# Altium project SOS_PAT.PrjPcb
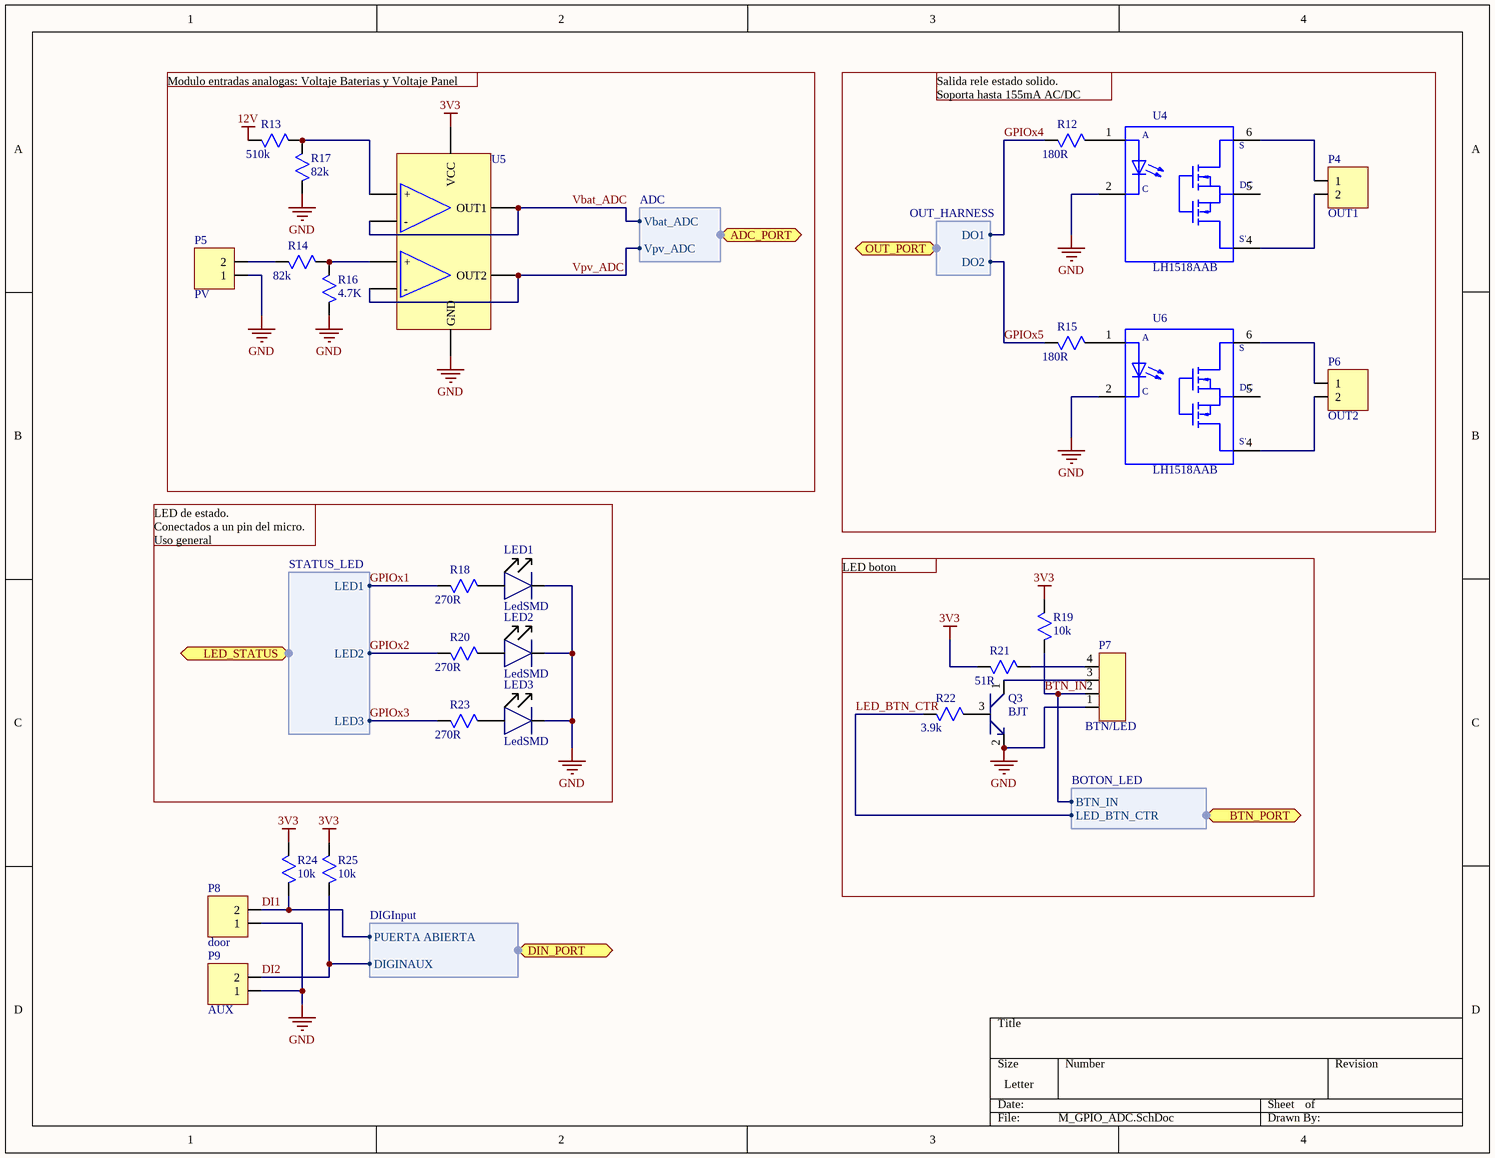
[diagram p0: M_GPIO_ADC.SchDoc]
4 sheets, 117 parts. Net scope: flat (ports and power ports of the same name join across sheets).
Board file: PATSOS_v1.PcbDoc
Sheets:
  M_GPIO_ADC.SchDoc
  M_microcontrolador.SchDoc
  M_Audio.SchDoc
  M_PWR.SchDoc

## Sheet M_GPIO_ADC.SchDoc
size Letter

### Parts
LED1  LedSMD  [SMD1206]
LED2  LedSMD  [SMD1206]
LED3  LedSMD  [SMD1206]
P4  OUT1  [TBHDR2P3.5VERTICAL]
P5  PV  [TBHDR2P3.5VERTICAL]
P6  OUT2  [TBHDR2P3.5VERTICAL]
P7  BTN/LED  [TBHDR4P3.5]
P8  door  [TBHDR2P3.5VERTICAL]
P9  AUX  [TBHDR2P3.5VERTICAL]
Q3  BJT  [BJT]
R12  value 180R  [ResistorSMD0805]  (hidden comment: ResistorSMD)
R13  value 510k  [ResistorSMD0805]  (hidden comment: ResistorSMD)
R14  value 82k  [ResistorSMD0805]  (hidden comment: ResistorSMD)
R15  value 180R  [ResistorSMD0805]  (hidden comment: ResistorSMD)
R16  value 4.7K  [ResistorSMD0805]  (hidden comment: ResistorSMD)
R17  value 82k  [ResistorSMD0805]  (hidden comment: ResistorSMD)
R18  value 270R  [ResistorSMD0805]  (hidden comment: ResistorSMD)
R19  value 10k  [ResistorSMD0805]  (hidden comment: ResistorSMD)
R20  value 270R  [ResistorSMD0805]  (hidden comment: ResistorSMD)
R21  value 51R  [ResistorSMD0805]  (hidden comment: ResistorSMD)
R22  value 3.9k  [ResistorSMD0805]  (hidden comment: ResistorSMD)
R23  value 270R  [ResistorSMD0805]  (hidden comment: ResistorSMD)
R24  value 10k  [ResistorSMD0805]  (hidden comment: ResistorSMD)
R25  value 10k  [ResistorSMD0805]  (hidden comment: ResistorSMD)
U4  LH1518AAB  [SOIC254P1005X390-6N]
U5  Operacional  [SO8]  (value not drawn)
U6  LH1518AAB  [SOIC254P1005X390-6N]

### Ports
ADC_PORT (harness ADC), BTN_PORT (harness BOTON_LED), DIN_PORT (harness DIGInput), LED_STATUS (harness STATUS_LED), OUT_PORT (harness OUT_HARNESS)

### Harnesses
ADC: Vbat_ADC, Vpv_ADC
STATUS_LED: LED1, LED2, LED3
BOTON_LED: BTN_IN, LED_BTN_CTR
OUT_HARNESS: DO1, DO2
DIGInput: PUERTA ABIERTA, DIGINAUX

### Nets
3V3: R19.2 R21.1 R24.2 R25.2 U5.8(VCC)
12V: R13.1
GND: LED1.1 LED2.1 LED3.1 P5.1 P7.1 P8.1 P9.1 Q3.2 R16.1 R17.1 U4.2(C) U5.4(GND) U6.2(C)  [project net GND-GSM]
BTN_IN: P7.2 R19.1 ; port BTN_PORT.BTN_IN
DI1: P8.2 R24.1 ; port DIN_PORT.PUERTA ABIERTA
DI2: P9.2 R25.1 ; port DIN_PORT.DIGINAUX
GPIOx1: R18.1 ; port LED_STATUS.LED1
GPIOx2: R20.1 ; port LED_STATUS.LED2
GPIOx3: R23.1 ; port LED_STATUS.LED3
GPIOx4: R12.1 ; port OUT_PORT.DO1
GPIOx5: R15.1 ; port OUT_PORT.DO2
LED_BTN_CTR: R22.1 ; port BTN_PORT.LED_BTN_CTR
Vbat_ADC: U5.1(OUT1) U5.2(-) ; port ADC_PORT.Vbat_ADC
Vpv_ADC: U5.6(-) U5.7(OUT2) ; port ADC_PORT.Vpv_ADC
NetLED1_2: LED1.2 R18.2
NetLED2_2: LED2.2 R20.2
NetLED3_2: LED3.2 R23.2
NetP4_1: P4.1 U4.6(S)
NetP4_2: P4.2 U4.4(S')
NetP5_2: P5.2 R14.1
NetP6_1: P6.1 U6.6(S)
NetP6_2: P6.2 U6.4(S')
NetP7_3: P7.3 Q3.1
NetP7_4: P7.4 R21.2
NetQ3_3: Q3.3 R22.2
NetR12_2: R12.2 U4.1(A)
NetR13_2: R13.2 R17.2 U5.3(+)
NetR14_2: R14.2 R16.2 U5.5(+)
NetR15_2: R15.2 U6.1(A)

Not connected (* = marked no-connect by the designer): U4 5(DC); U6 5(DC)

### Notes on the sheet
- Modulo entradas analogas: Voltaje Baterias y Voltaje Panel solar
- Salida rele estado solido.
  Soporta hasta 155mA AC/DC
- LED de estado.
  Conectados a un pin del micro.
  Uso general
- LED boton

### Library data of the parts
LED1-LED3 = LedSMD: Discrete Led SMD 1205 Green; PartNo: LTST-C150GKT; Manufacturer Name: Lite-On Inc.; PartDescription: LED GREEN CLEAR 1206 SMD; Type: Surface Mount; Digi-Key Part Number: 160-1169-1-ND; Package: 1206 (3216 Metric); Distributors Part Number: 160-1169-1-ND; Manufacturers Part Number: LTST-C150GKT
P4-P6 P8 P9 = TBHDR2P3.5: Connector 2 positions with pitch 3.5mm; PartNo: 691321100002; Manufacturer Name: Wurth Electronics Inc.; PartDescription: TERM BLOCK HDR 2POS VERT 3.5MM; Digi-Key Part Number: 732-2763-ND; Package: 0.138" (3.50mm) Vertical Through Hole; Distributors Part Number: 732-2763-ND; Manufacturers Part Number: 691321100002; Type: Through Hole; Value: 2 Position
P7 = TBHDR4P3.5: Connector 4 positions; PartNo: 691321100004; Manufacturer Name: Wurth Electronics Inc.; PartDescription: TERM BLOCK HDR 4POS VERT 3.5MM; Digi-Key Part Number: 732-2765-ND; Package: 0.138" (3.50mm) Vertical Through Hole; Distributors Part Number: 732-2765-ND; Manufacturers Part Number: 691321100004; Type: Through Hole; Value: 4 Position
Q3 = BJT: Transistor BJT; Manufacturer Name: Diodes Incorporated; Manufacturers Part Number: MMBT2222A-7-F; PartDescription: TRANS NPN 40V 0.6A SMD SOT23-3; Type: Surface Mount; Digi-Key Part Number: MMBT2222A-FDICT-ND; Distributors Part Number: MMBT2222A-FDICT-ND; Package: TO-236-3, SC-59, SOT-23-3; PartNo: MMBT2222A-7-F
R12 R15 = ResistorSMD: Chip Resistor SMD; Manufacturer Name: Yageo; Manufacturers Part Number: RC0805FR-07180RL; PartDescription: RES SMD 180 OHM 1% 1/8W 0805; Digi-Key Part Number: 311-180CRCT-ND; Distributors Part Number: 311-180CRCT-ND; Package: 0805 (2012 Metric); PartNo: RC0805FR-07180RL; Type: Surface Mount
R13 = ResistorSMD: Chip Resistor SMD; PartNo: RC0805FR-07510KL; Manufacturer Name: Yageo; PartDescription: RES SMD 510K OHM 1% 1/8W 0805; Digi-Key Part Number: 311-510KCRCT-ND; Package: 0805; Distributors Part Number: 311-510KCRCT-ND; Manufacturers Part Number: RC0805FR-07510KL; Type: Surface Mount
R14 R17 = ResistorSMD: Chip Resistor SMD; PartNo: RC0805FR-0782KL; Manufacturer Name: Yageo; PartDescription: RES SMD 82K OHM 1% 1/8W 0805; Digi-Key Part Number: 311-82.0KCRCT-ND; Package: 0805; Distributors Part Number: 311-82.0KCRCT-ND; Manufacturers Part Number: RC0805FR-0782KL; Type: Surface Mount
R16 = ResistorSMD: Chip Resistor SMD; PartNo: ERJ-6GEYJ472V; Manufacturer Name: Panasonic Electronic Components; PartDescription: RES SMD 4.7K OHM 5% 1/8W 0805; Digi-Key Part Number: P4.7KACT-ND; Package: 0805 (2012 Metric); Distributors Part Number: P4.7KACT-ND; Manufacturers Part Number: ERJ-6GEYJ472V; Type: Surface Mount
R18 R20 R23 = ResistorSMD: Chip Resistor SMD; Manufacturer Name: Panasonic Electronic Components; Manufacturers Part Number: ERJ-6ENF2700V; PartDescription: RES SMD 270 OHM 1% 1/8W 0805; Digi-Key Part Number: P270CCT-ND; Distributors Part Number: P270CCT-ND; Package: 0805 (2012 Metric); PartNo: ERJ-6ENF2700V; Type: Surface Mount
R19 R24 R25 = ResistorSMD: Chip Resistor SMD; Manufacturer Name: Yageo; Manufacturers Part Number: RC0805FR-0710KL; PartDescription: RES SMD 10K OHM 1% 1/8W 0805; Digi-Key Part Number: 311-10.0KCRCT-ND; Distributors Part Number: 311-10.0KCRCT-ND; Type: Surface Mount; Package: 0805 (2012 Metric); PartNo: RC0805FR-0710KL
R21 = ResistorSMD: Chip Resistor SMD; Manufacturer Name: Bourns Inc.; Manufacturers Part Number: CRM0805-FX-51R0ELF; PartDescription: RES SMD 51 OHM 1% 1/4W 0805; Digi-Key Part Number: CRM0805-FX-51R0ELFCT-ND; Distributors Part Number: CRM0805-FX-51R0ELFCT-ND; Package: 0805 (2012 Metric); PartNo: CRM0805-FX-51R0ELF; Type: Surface Mount
R22 = ResistorSMD: Chip Resistor SMD; Manufacturer Name: Yageo; Manufacturers Part Number: RC0603FR-073K9L; PartDescription: RES SMD 3.9K OHM 1% 1/10W 0603; Digi-Key Part Number: 311-3.90KHRCT-ND; Distributors Part Number: 311-3.90KHRCT-ND; Package: 0603 (1608 Metric); PartNo: RC0603FR-073K9L; Type: Surface Mount
U4 U6 = LH1518AAB: LH1518AAB Series SPST _1 Form A_ Solid State Relay Surface Mount - SMD-6; Manufacturer Name: Vishay; PartDescription: SSR RELAY SPST-NO 300MA 0-250V; Package: 6-SMD (0.300", 7.62mm); Value: *; Digi-Key Part Number: LH1518AAB-ND; Distributors Part Number: LH1518AAB-ND; Manufacturers Part Number: LH1518AAB; PartNo: LH1518AAB; Type: Surface Mount
U5 = Operacional: 2channel Vcc=4-16Vmax; PartNo: LM358DT; Manufacturer Name: STMicroelectronics; PartDescription: IC OPAMP GP 1.1MHZ 8SO; Digi-Key Part Number: 497-1591-1-ND; Distributors Part Number: 497-1591-1-ND; Manufacturers Part Number: LM358DT; Package: 8-SOIC (0.154", 3.90mm Width); Type: Surface Mount

## Sheet M_microcontrolador.SchDoc
size Legal
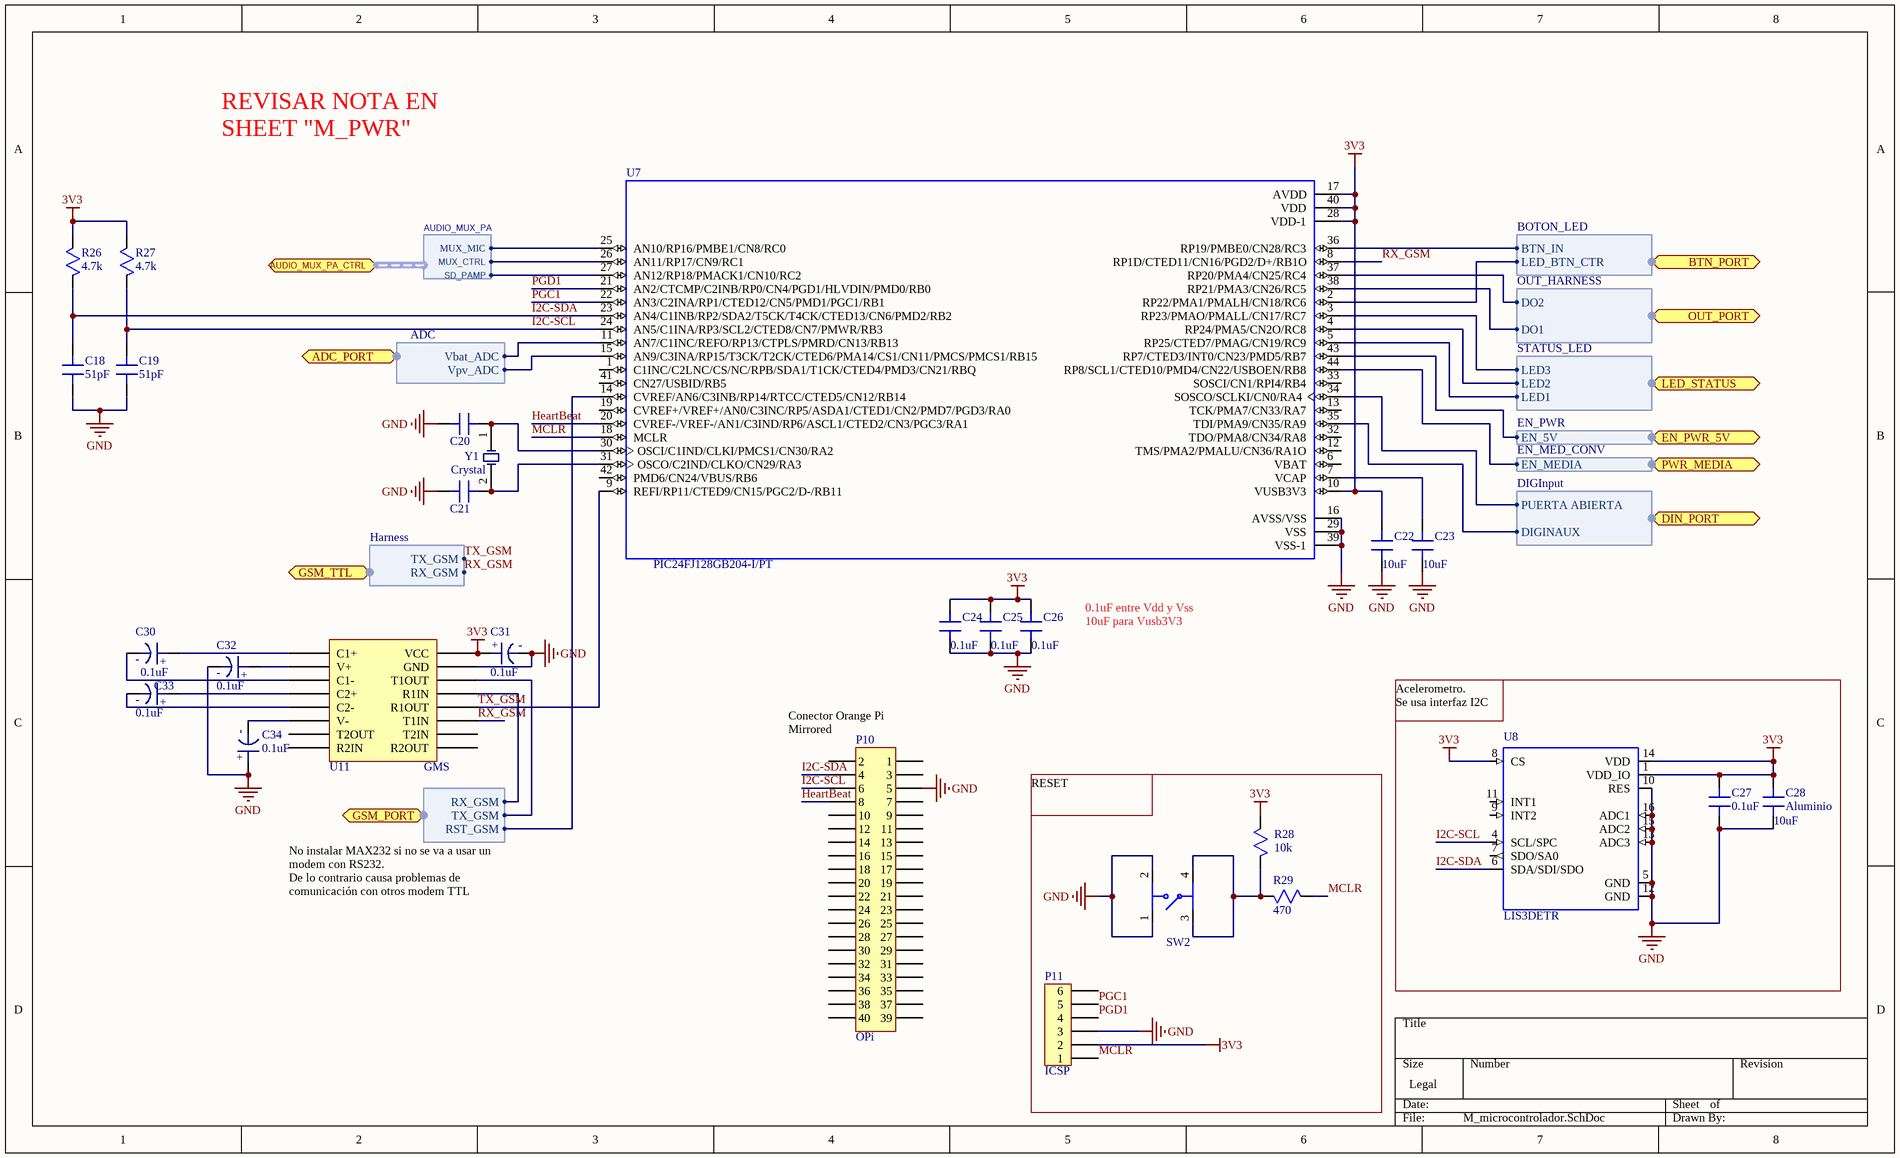
[diagram p1: M_microcontrolador.SchDoc]

### Parts
C18  51pF  [Capacitor0805]
C19  51pF  [Capacitor0805]
C20  CapacitorSMD  [Capacitor0805]  (value not drawn)
C21  CapacitorSMD  [Capacitor0805]  (value not drawn)
C22  value 10uF  [Capacitor0805]  (hidden comment: CapacitorSMD)
C23  value 10uF  [Capacitor0805]  (hidden comment: CapacitorSMD)
C24  value 0.1uF  [Capacitor0805]  (hidden comment: CapacitorSMD)
C25  value 0.1uF  [Capacitor0805]  (hidden comment: CapacitorSMD)
C26  value 0.1uF  [Capacitor0805]  (hidden comment: CapacitorSMD)
C27  value 0.1uF  [Capacitor0805]  (hidden comment: CapacitorSMD)
C28  Aluminio  value 10uF  [Capacitor0805]
C30  0.1uF  [CAPACITORE0805]
C31  0.1uF  [CAPACITORE0805]
C32  0.1uF  [CAPACITORE0805]
C33  0.1uF  [CAPACITORE0805]
C34  0.1uF  [CAPACITORE0805]
P10  OPi  [MALE2x20PIN]
P11  ICSP  [MALE6PIN]
R26  4.7k  [ResistorSMD0805]
R27  4.7k  [ResistorSMD0805]
R28  10k  [ResistorSMD0805]
R29  470  [ResistorSMD1206]
SW2  Tactile Switch  [TactileSwitch]  (value not drawn)
U7  PIC24FJ128GB204-I/PT  [QFP80P1200X1200X120-44N]
U8  LIS3DETR  [LGA16R50P5X3_300X300X100N]
U11  SP3232EBCN  [SP3232EBCN]  (value not drawn)
Y1  Crystal  [CRYSTALSMDMini]

### Ports
ADC_PORT (harness ADC), AUDIO_MUX_PA_CTRL (harness AUDIO_MUX_PA), BTN_PORT (harness BOTON_LED), DIN_PORT (harness DIGInput), EN_PWR_5V (harness EN_PWR), GSM_PORT (harness GMS), GSM_TTL (harness Harness), LED_STATUS (harness STATUS_LED), OUT_PORT (harness OUT_HARNESS), PWR_MEDIA (harness EN_MED_CONV)

### Harnesses
ADC: Vbat_ADC, Vpv_ADC
STATUS_LED: LED1, LED2, LED3
BOTON_LED: BTN_IN, LED_BTN_CTR
OUT_HARNESS: DO1, DO2
DIGInput: PUERTA ABIERTA, DIGINAUX
EN_PWR: EN_5V
EN_MED_CONV: EN_MEDIA
AUDIO_MUX_PA: SD_PAMP, MUX_CTRL, MUX_MIC
GMS: RST_GSM, RX_GSM, TX_GSM
Harness: RX_GSM, TX_GSM

### Nets
3V3: C22.2 C24.2 C25.2 C26.2 C27.2 C28.2 C31.1 P11.2 R26.2 R27.2 R28.2 U7.10(VUSB3V3) U7.17(AVDD) U7.28(VDD-1) U7.40(VDD) U8.1(VDD_IO) U8.8(CS) U8.14(VDD) U11.16(VCC)
GND: C18.2 C19.2 C20.1 C21.1 C22.1 C23.1 C24.1 C25.1 C26.1 C27.1 C28.1 C31.2 C32.2 C34.1 P10.5 P11.3 SW2.1 SW2.2 U7.16(AVSS/VSS) U7.29(VSS) U7.39(VSS-1) U8.5(GND) U8.10(RES) U8.12(GND) U8.13(ADC3) U8.15(ADC2) U8.16(ADC1) U11.15(GND)  [project net GND-GSM]
A_MUX_CTRL: U7.26(AN11/RP17/CN9/RC1) ; port AUDIO_MUX_PA_CTRL.MUX_CTRL
BTN_IN: U7.36(RP19/PMBE0/CN28/RC3) ; port BTN_PORT.BTN_IN
DI1: U7.34(SOSCO/SCLKI/CN0/RA4) ; port DIN_PORT.PUERTA ABIERTA
DI2: U7.35(TDI/PMA9/CN35/RA9) ; port DIN_PORT.DIGINAUX
EN_5V: U7.43(RP7/CTED3/INT0/CN23/PMD5/RB7) ; port EN_PWR_5V.EN_5V
EN_MEDIA_CONVERTER: U7.44(RP8/SCL1/CTED10/PMD4/CN22/USBOEN/RB8) ; port PWR_MEDIA.EN_MEDIA
GPIOx1: U7.5(RP25/CTED7/PMAG/CN19/RC9) ; port LED_STATUS.LED1
GPIOx2: U7.4(RP24/PMA5/CN2O/RC8) ; port LED_STATUS.LED2
GPIOx3: U7.3(RP23/PMAO/PMALL/CN17/RC7) ; port LED_STATUS.LED3
GPIOx4: U7.38(RP21/PMA3/CN26/RC5) ; port OUT_PORT.DO1
GPIOx5: U7.37(RP20/PMA4/CN25/RC4) ; port OUT_PORT.DO2
HeartBeat: P10.8 U7.20(CVREF-/VREF-/AN1/C3IND/RP6/ASCL1/CTED2/CN3/PGC3/RA1)
I2C-SCL: C19.1 P10.6 R27.1 U7.24(AN5/C1INA/RP3/SCL2/CTED8/CN7/PMWR/RB3) U8.4(SCL/SPC)
I2C-SDA: C18.1 P10.4 R26.1 U7.23(AN4/C1INB/RP2/SDA2/T5CK/T4CK/CTED13/CN6/PMD2/RB2) U8.6(SDA/SDI/SDO)
LED_BTN_CTR: U7.2(RP22/PMA1/PMALH/CN18/RC6) ; port BTN_PORT.LED_BTN_CTR
MCLR: P11.1 R29.2 U7.18(MCLR)
PGC1: P11.5 U7.22(AN3/C2INA/RP1/CTED12/CN5/PMD1/PGC1/RB1)
PGD1: P11.4 U7.21(AN2/CTCMP/C2INB/RP0/CN4/PGD1/HLVDIN/PMD0/RB0)
RST-GSM: U7.14(CVREF/AN6/C3INB/RP14/RTCC/CTED5/CN12/RB14) ; port GSM_PORT.RST_GSM
RX-GSM: U11.13(R1IN) ; port GSM_PORT.RX_GSM
RX_GSM: U7.8(RP1D/CTED11/CN16/PGD2/D+/RB1O) U11.11(T1IN) ; port GSM_TTL.RX_GSM
SD_TPA3111: U7.27(AN12/RP18/PMACK1/CN10/RC2) ; port AUDIO_MUX_PA_CTRL.SD_PAMP
TX-GSM: U11.14(T1OUT) ; port GSM_PORT.TX_GSM
TX_GSM: U7.9(REFI/RP11/CTED9/CN15/PGC2/D-/RB11) U11.12(R1OUT) ; port GSM_TTL.TX_GSM
Vbat_ADC: U7.11(AN7/C1INC/REFO/RP13/CTPLS/PMRD/CN13/RB13) ; port ADC_PORT.Vbat_ADC
Vpv_ADC: U7.15(AN9/C3INA/RP15/T3CK/T2CK/CTED6/PMA14/CS1/CN11/PMCS/PMCS1/RB15) ; port ADC_PORT.Vpv_ADC
NetC20_2: C20.2 U7.30(OSCI/C1IND/CLKI/PMCS1/CN30/RA2) Y1.1
NetC21_2: C21.2 U7.31(OSCO/C2IND/CLKO/CN29/RA3) Y1.2
NetC23_2: C23.2 U7.7(VCAP)
NetC30_1: C30.1 U11.1(C1+)
NetC30_2: C30.2 U11.3(C1-)
NetC32_1: C32.1 U11.2(V+)
NetC33_1: C33.1 U11.4(C2+)
NetC33_2: C33.2 U11.5(C2-)
NetC34_2: C34.2 U11.6(V-)
NetR1_1: U7.25(AN10/RP16/PMBE1/CN8/RC0) ; port AUDIO_MUX_PA_CTRL.MUX_MIC
NetR28_1: R28.1 R29.1 SW2.3 SW2.4

Not connected (* = marked no-connect by the designer): P10 1 2 3 7 9 10 11 12 13 14 15 16 17 18 19 20 21 22 23 24 25 26 27 28 29 30 31 32 33 34 35 36 37 38 39 40; P11 6; U7 1(C1INC/C2LNC/CS/NC/RPB/SDA1/T1CK/CTED4/PMD3/CN21/RBQ) 6(VBAT) 12(TMS/PMA2/PMALU/CN36/RA1O) 13(TCK/PMA7/CN33/RA7) 19(CVREF+/VREF+/AN0/C3INC/RP5/ASDA1/CTED1/CN2/PMD7/PGD3/RA0) 32(TDO/PMA8/CN34/RA8) 33(SOSCI/CN1/RPI4/RB4) 41(CN27/USBID/RB5) 42(PMD6/CN24/VBUS/RB6); U8 7(SDO/SA0) 9(INT2) 11(INT1); U11 7(T2OUT) 8(R2IN) 9(R2OUT) 10(T2IN)

### Notes on the sheet
- REVISAR NOTA EN SHEET "M_PWR"
- 0.1uF entre Vdd y Vss
  10uF para Vusb3V3
- (near P10) Conector Orange Pi
  Mirrored
- (near U8) Acelerometro.
  Se usa interfaz I2C
- RESET
- No instalar MAX232 si no se va a usar un modem con RS232.
  De lo contrario causa problemas de comunicación con otros modem TTL
- (in symbol CapacitorESMD) -; +

### Library data of the parts
C18 C19 = CapacitorSMD: Ceramic Capacitor; PartNo: CL21C510JBANNNC; Manufacturer Name: Samsung Electro-Mechanics; PartDescription: CAP CER 51PF 50V C0G/NP0 0805; Type: Surface Mount; Digi-Key Part Number: 1276-2670-1-ND; Value: 51pF; Package: 0805; Distributors Part Number: 1276-2670-1-ND; Manufacturers Part Number: CL21C510JBANNNC
C20 C21 = CapacitorSMD: Ceramic Capacitor; PartNo: 08051A6R0CAT2A; Manufacturer Name: AVX Corporation; PartDescription: CAP CER 6PF 100V NP0 0805; Value: 6pF; Type: Surface Mount; Digi-Key Part Number: 478-10411-1-ND; Package: 0805; Distributors Part Number: 478-10411-1-ND; Manufacturers Part Number: 08051A6R0CAT2A
C22 C23 C28 = CapacitorSMD: Ceramic Capacitor; PartNo: CC0805ZKY5V6BB106; Manufacturer Name: Yageo; PartDescription: CAP CER 10UF 10V Y5V 0805; Type: Surface Mount; Digi-Key Part Number: 311-1355-1-ND; Package: 0805; Distributors Part Number: 311-1355-1-ND; Manufacturers Part Number: CC0805ZKY5V6BB106
C24-C27 = CapacitorSMD: Ceramic Capacitor; PartNo: CC0805KRX7R8BB104; Manufacturer Name: Yageo; PartDescription: CAP CER 0.1UF 25V X7R 0805; Type: Surface Mount; Digi-Key Part Number: 311-1141-1-ND; Distributors Part Number: 311-1141-1-ND; Manufacturers Part Number: CC0805KRX7R8BB104
  C24: package: 0805
  C25-C27: Package: 0805
C30-C34 = CapacitorESMD: Electrolitic Capacitor; PartNo: CC0805KRX7R8BB104; Manufacturer Name: Yageo; PartDescription: CAP CER 0.1UF 25V X7R 0805; Type: Surface Mount; Digi-Key Part Number: 311-1141-1-ND; Value: 0.1uF; Package: 0805; Distributors Part Number: 311-1141-1-ND; Manufacturers Part Number: CC0805KRX7R8BB104
P10 = PHM2x20P2.54: Pin Header Male 40 Pins Pitch 2.54mm; PartNo: CONN HDR 40POS 0.1 GOLD PCB; Manufacturer Name: Sullins Connector Solutions; Digi-Key Part Number: S7123-ND; Package: Connector 0.100" (2.54mm) Through Hole; Distributors Part Number: S7123-ND; Manufacturers Part Number: CONN HDR 40POS 0.1 GOLD PCB; PartDescription: CONN HDR 40POS 0.1 GOLD PCB; Type: Through Hole
P11 = PHM1x6P2.54: Pin Header Male 6 Pins Pitch 2.54mm; PartNo: CONN HEADER R/A 6POS 2.54MM; Manufacturer Name: Harwin Inc.; Digi-Key Part Number: 952-2247-ND; Package: 0.100" (2.54mm); Distributors Part Number: 952-2247-ND; Manufacturers Part Number: CONN HEADER R/A 6POS 2.54MM; PartDescription: CONN HEADER R/A 6POS 2.54MM; Type: Through Hole
R26 R27 = ResistorSMD: Chip Resistor SMD; Manufacturer Name: Panasonic Electronic Components; Manufacturers Part Number: ERJ-6GEYJ472V; PartDescription: RES SMD 4.7K OHM 5% 1/8W 0805; Digi-Key Part Number: P4.7KACT-ND; Value: 4.7K; Distributors Part Number: P4.7KACT-ND; Package: 0805 (2012 Metric); PartNo: ERJ-6GEYJ472V; Type: Surface Mount
R28 = ResistorSMD: Chip Resistor SMD; Manufacturer Name: Yageo; Manufacturers Part Number: RC0805JR-0710KL; PartDescription: RES SMD 10K OHM 5% 1/8W 0805; Digi-Key Part Number: 311-10KARCT-ND; Value: 10k; Distributors Part Number: 311-10KARCT-ND; Package: 0805; PartNo: RC0805JR-0710KL; Type: Surface Mount
R29 = ResistorSMD: Chip Resistor SMD; Manufacturer Name: Samsung Electro-Mechanics; Manufacturers Part Number: RC3216J471CS; PartDescription: RES SMD 470 OHM 5% 1/4W 1206; Value: 470R; Digi-Key Part Number: 1276-5903-1-ND; Distributors Part Number: 1276-5903-1-ND; Package: 1206 (3216 Metric); PartNo: RC3216J471CS; Type: Surface Mount
SW2 = Tactile Switch: Switch Contact; Manufacturer Name: C&K; Manufacturers Part Number: PTS645SM43SMTR92 LFS; PartDescription: SWITCH TACTILE SPST-NO 0.05A 12V; Digi-Key Part Number: CKN9112CT-ND; Distributors Part Number: CKN9112CT-ND; Package: 6.00mm x 6.00mm; PartNo: PTS645SM43SMTR92 LFS; Type: Surface Mount
U7 = PIC24FJ128GB204-I/PT: 128KB Flash, 8KB RAM, 16 MIPS, USB OTG, Crypto, 44 TQFP 10x10x1mm TRAY; Manufacturer Name: Microchip; PartDescription: IC MCU 16BIT 128KB FLASH 44TQFP; Package: 44-TQFP; Value: *; Digi-Key Part Number: PIC24FJ128GB204-I/PT-ND; Distributors Part Number: PIC24FJ128GB204-I/PT-ND; Manufacturers Part Number: PIC24FJ128GB204-I/PT; PartNo: PIC24FJ128GB204-I/PT; Type: Surface Mount
U8 = LIS3DETR: MEMS digital output motion sensor ultra low-power high performance 3-axes nano accelerometer; Manufacturer Name: STMicroelectronics; PartDescription: ACCEL 2-16G I2C/SPI 16LGA; Package: 16-VFLGA; Value: *; Digi-Key Part Number: 497-16262-1-ND; Distributors Part Number: 497-16262-1-ND; Manufacturers Part Number: LIS3DETR; PartNo: LIS3DETR; Type: Surface Mount
U11 = SP3232EBCN: Serial Adapter RS232; Manufacturer Name: MaxLinear, Inc.; Manufacturers Part Number: SP3232ECN-L/TR; PartDescription: IC TXRX RS232 ESD TRUE 16SOIC; Digi-Key Part Number: 1016-1803-1-ND; Distributors Part Number: 1016-1803-1-ND; Package: 16-SOIC (0.154", 3.90mm Width); PartNo: SP3232ECN-L/TR; Type: Surface Mount
Y1 = Crystal: Crystal SMD; Manufacturer Name: ECS Inc.; Manufacturers Part Number: ECS-240-8-30B-CKM; PartDescription: CRYSTAL 24.0000MHZ 8PF SMD; Value: 24MHz; Digi-Key Part Number: XC1842CT-ND; Distributors Part Number: XC1842CT-ND; Package: 4-SMD, No Lead; PartNo: ECS-240-8-30B-CKM; Type: Surface Mount

## Sheet M_Audio.SchDoc
size Letter
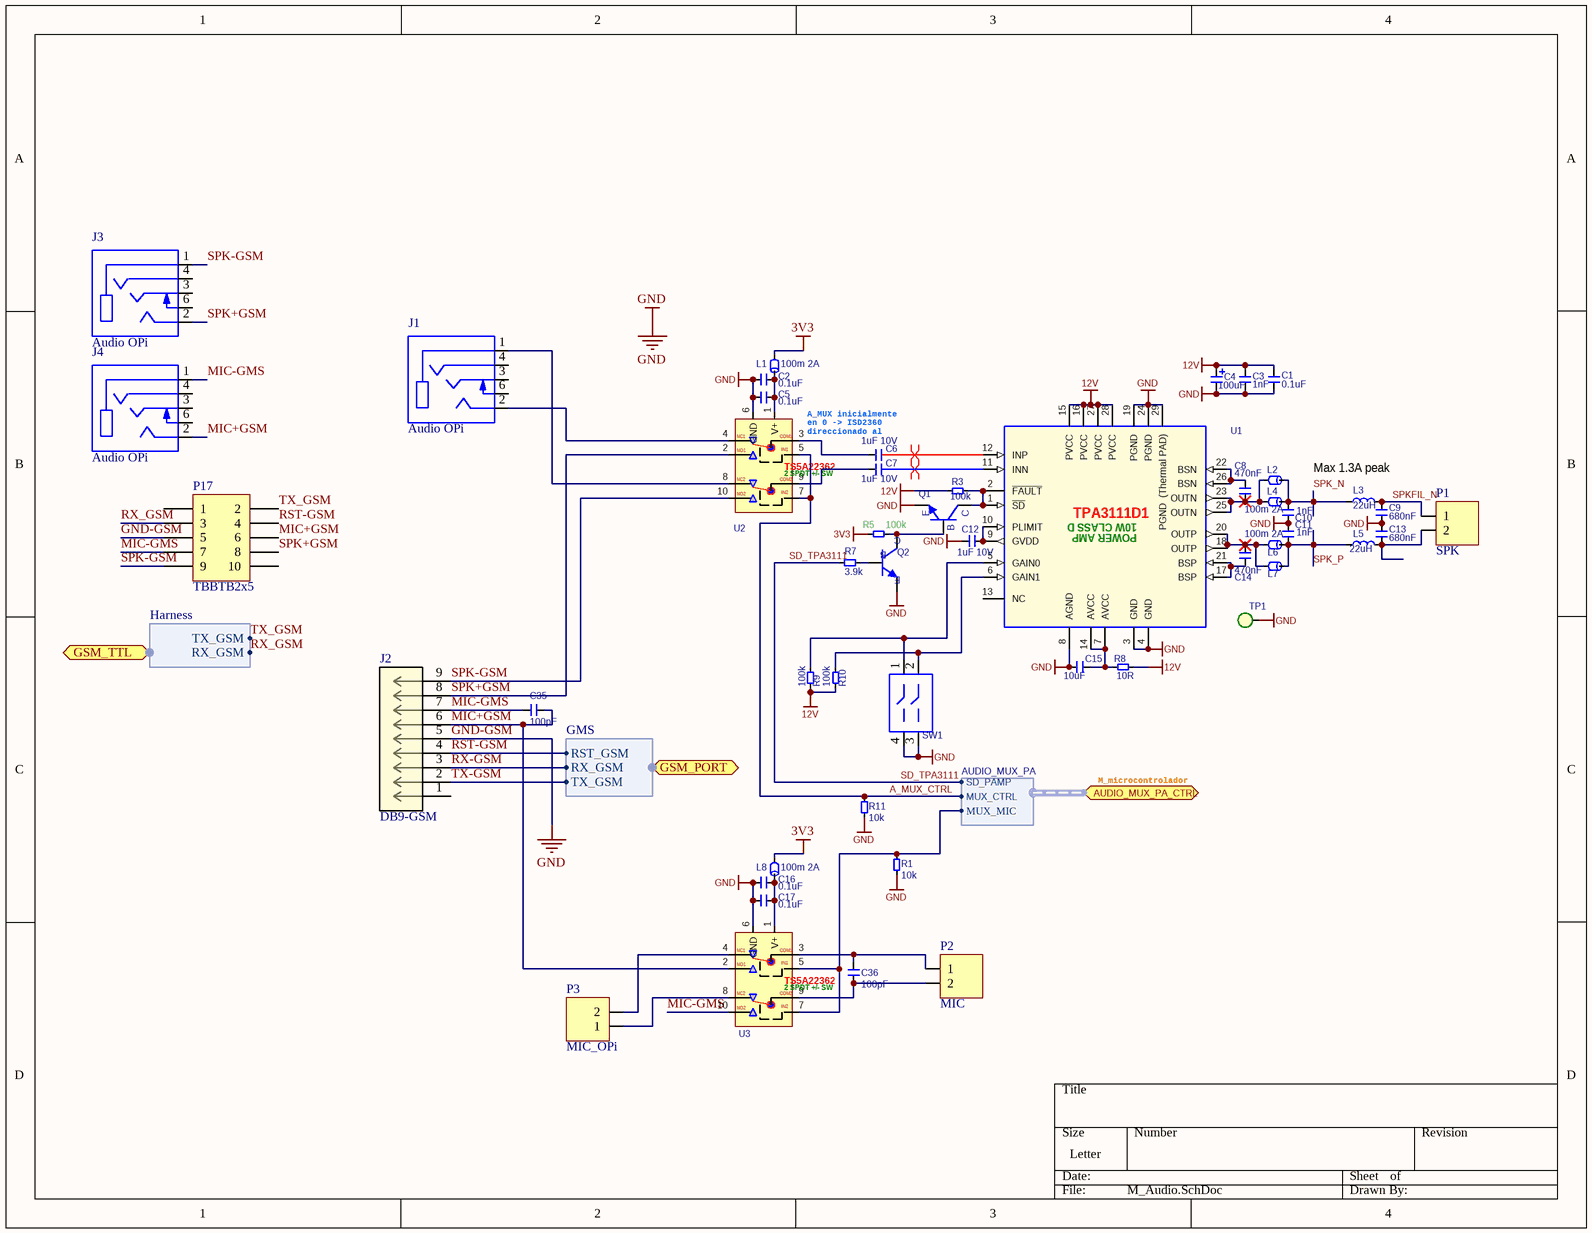
[diagram p2: M_Audio.SchDoc]

### Parts
C1  value 0.1uF  [PASS_CAPC0603 - REFLOW]  (hidden comment: PASS_CAP_EIL)
C2  value 0.1uF  [PASS_CAPC0603 - REFLOW]  (hidden comment: PASS_CAP_EIL)
C3  value 1nF  [PASS_CAPC0603 - REFLOW]  (hidden comment: PASS_CAP_EIL)
C4  value 100uF  [PASS_CAPPOL_SMD-F]  (hidden comment: PASS_CAPPOL_EIL)
C5  value 0.1uF  [PASS_CAPC0603 - REFLOW]  (hidden comment: PASS_CAP_EIL)
C6  value 1uF 10V  [PASS_CAPC0603 - REFLOW]  (hidden comment: PASS_CAP_EIL)
C7  value 1uF 10V  [PASS_CAPC0603 - REFLOW]  (hidden comment: PASS_CAP_EIL)
C8  value 470nF  [PASS_CAPC0603 - REFLOW]  (hidden comment: PASS_CAP_EIL)
C9  value 680nF  [PASS_CAPC1206 - REFLOW]  (hidden comment: PASS_CAP_EIL)
C10  value 1nF  [PASS_CAPC0603 - REFLOW]  (hidden comment: PASS_CAP_EIL)
C11  value 1nF  [PASS_CAPC0603 - REFLOW]  (hidden comment: PASS_CAP_EIL)
C12  value 1uF 10V  [PASS_CAPC0603 - REFLOW]  (hidden comment: PASS_CAP_EIL)
C13  value 680nF  [PASS_CAPC1206 - REFLOW]  (hidden comment: PASS_CAP_EIL)
C14  value 470nF  [PASS_CAPC0603 - REFLOW]  (hidden comment: PASS_CAP_EIL)
C15  value 10uF  [PASS_CAPC0805 - REFLOW]  (hidden comment: PASS_CAP_EIL)
C16  value 0.1uF  [PASS_CAPC0603 - REFLOW]  (hidden comment: PASS_CAP_EIL)
C17  value 0.1uF  [PASS_CAPC0603 - REFLOW]  (hidden comment: PASS_CAP_EIL)
C35  value 100pF  [PASS_CAPC0603 - REFLOW]  (hidden comment: PASS_CAP_EIL)
C36  value 100pF  [PASS_CAPC0603 - REFLOW]  (hidden comment: PASS_CAP_EIL)
J1  Audio OPi  [CUI_SJ-43515RS-SMT]
J2  DB9-GSM  [CONN_5747844-6]
J3  Audio OPi  [CUI_SJ-43515RS-SMT]
J4  Audio OPi  [CUI_SJ-43515RS-SMT]
L1  value 100m 2A  [PASS_FER0805 - REFLOW]  (hidden comment: PASS_FERRITEBEAD_EIL)
L2  PASS_FERRITEBEAD_EIL  [PASS_FER1812 - REFLOW]  (value not drawn)
L3  value 22uH  [PASS_INDUCT_BOURNS_SRU1063]  (hidden comment: PASS_L_EIL)
L4  value 100m 2A  [PASS_FER0805 - REFLOW]  (hidden comment: PASS_FERRITEBEAD_EIL)
L5  value 22uH  [PASS_INDUCT_BOURNS_SRU1063]  (hidden comment: PASS_L_EIL)
L6  value 100m 2A  [PASS_FER0805 - REFLOW]  (hidden comment: PASS_FERRITEBEAD_EIL)
L7  PASS_FERRITEBEAD_EIL  [PASS_FER1812 - REFLOW]  (value not drawn)
L8  value 100m 2A  [PASS_FER0805 - REFLOW]  (hidden comment: PASS_FERRITEBEAD_EIL)
P1  SPK  [TBHDR2P3.5VERTICAL]
P2  MIC  [TBHDR2P3.5VERTICAL]
P3  MIC_OPi  [TBHDR2P3.5VERTICAL]
P17  TBBTB2x5  [TBBTB2x5]
Q1  TRAN_BJT_NPN_EIL  [3PIN_SOT-23 BJT - REFLOW]  (value not drawn)
Q2  TRAN_BJT_NPN_EIL  [3PIN_SOT-23 BJT - REFLOW]  (value not drawn)
R1  value 10k  [PASS_RESC0805 - REFLOW]  (hidden comment: PASS_R_EIL)
R3  value 100k  [PASS_RESC0603 - REFLOW]  (hidden comment: PASS_R_EIL)
R5  value 100k  [PASS_RESC0603 - REFLOW]  (hidden comment: PASS_R_EIL)
R7  value 3.9k  [PASS_RESC0603 - REFLOW]  (hidden comment: PASS_R_EIL)
R8  value 10R  [PASS_RESC0603 - REFLOW]  (hidden comment: PASS_R_EIL)
R9  value 100k  [PASS_RESC0603 - REFLOW]  (hidden comment: PASS_R_EIL)
R10  value 100k  [PASS_RESC0603 - REFLOW]  (hidden comment: PASS_R_EIL)
R11  value 10k  [PASS_RESC0805 - REFLOW]  (hidden comment: PASS_R_EIL)
SW1  SW_DIP2_EIL  [SWIT_DIP-2- RAISED THR]  (value not drawn)
TP1  TEST POINT_EIL  [MISC_TESTPOINT THR]  (value not drawn)
U1  AUDIO AMP_TPA3111D1_28-TSSOP-EP_EIL  [CHIP_TSSOP-28 EXPOSED PAD LARGO 9.7MM/ANCHO 4.4MM/PITCH 0.65MM - REFLOW]  (value not drawn)
U2  MUXA_TS5A22362DGSR_10-MSOP_EIL  [CHIP_MSOP-10 LARGO 3.0MM/ANCHO 3.0MM/PITCH 0.5MM - REFLOW]  (value not drawn)
U3  MUXA_TS5A22362DGSR_10-MSOP_EIL  [CHIP_MSOP-10 LARGO 3.0MM/ANCHO 3.0MM/PITCH 0.5MM - REFLOW]  (value not drawn)

### Ports
AUDIO_MUX_PA_CTRL (harness AUDIO_MUX_PA), GSM_PORT (harness GMS), GSM_TTL (harness Harness)

### Harnesses
AUDIO_MUX_PA: SD_PAMP, MUX_CTRL, MUX_MIC
GMS: RST_GSM, RX_GSM, TX_GSM
Harness: RX_GSM, TX_GSM

### Nets
3V3: L1.1 L8.1 R5.2
12V: C1.1 C3.2 C4.1 R3.2 R8.1 R9.2 R10.2 U1.15(PVCC) U1.16(PVCC) U1.27(PVCC) U1.28(PVCC)
GND-GSM: C1.2 C2.2 C3.1 C4.2 C5.2 C9.1 C10.1 C11.2 C12.2 C13.2 C15.1 C16.2 C17.2 J2.5 P17.5 Q1.E Q2.E R1.2 R11.2 SW1.3 SW1.4 TP1.1 U1.3(GND) U1.4(GND) U1.8(AGND) U1.19(PGND) U1.24(PGND) U1.29(PGND__(Thermal_PAD)) U2.6(GND) U3.6(GND)  [also labelled GND]
A_MUX_CTRL: R11.1 U2.5(IN1) U2.7(IN2) ; port AUDIO_MUX_PA_CTRL.MUX_CTRL
MIC+GSM: C35.2 J2.6 J4.2(TIP) P17.6 U3.2(NO1)
MIC-GMS: C35.1 J2.7 J4.1(SLEEVE) P17.7 U3.10(NO2)
RST-GSM: J2.4 P17.4 ; port GSM_PORT.RST_GSM
RX-GSM: J2.3 ; port GSM_PORT.RX_GSM
RX_GSM: P17.3 ; port GSM_TTL.RX_GSM
SD_TPA3111: R7.1 ; port AUDIO_MUX_PA_CTRL.SD_PAMP
SPK+GSM: J2.8 J3.2(TIP) P17.8 U2.2(NO1)
SPK-GSM: J2.9 J3.1(SLEEVE) P17.9 U2.10(NO2)
SPK_N: C10.2 L2.2 L3.1 L4.2
SPK_P: C11.1 L5.1 L6.2 L7.2
SPKFIL_N: C9.2 L3.2 P1.1
TX-GSM: J2.2 ; port GSM_PORT.TX_GSM
TX_GSM: P17.2 ; port GSM_TTL.TX_GSM
NetC2_1: C2.1 C5.1 L1.2 U2.1(V+)
NetC6_1: C6.1 U2.3(COM1)
NetC6_2: C6.2 U1.12(INP)
NetC7_1: C7.1 U2.9(COM2)
NetC7_2: C7.2 U1.11(INN)
NetC8_1: C8.1 U1.22(BSN) U1.26(BSN)
NetC8_2: C8.2 L2.1 L4.1 U1.23(OUTN) U1.25(OUTN)
NetC12_1: C12.1 U1.9(GVDD) U1.10(PLIMIT)
NetC13_1: C13.1 L5.2 P1.2
NetC14_1: C14.1 L6.1 L7.1 U1.18(OUTP) U1.20(OUTP)
NetC14_2: C14.2 U1.17(BSP) U1.21(BSP)
NetC15_2: C15.2 R8.2 U1.7(AVCC) U1.14(AVCC)
NetC16_1: C16.1 C17.1 L8.2 U3.1(V+)
NetC36_1: C36.1 P2.2 U3.9(COM2)
NetC36_2: C36.2 P2.1 U3.3(COM1)
NetJ1_1: J1.1(SLEEVE) U2.8(NC2)
NetJ1_2: J1.2(TIP) U2.4(NC1)
NetP3_1: P3.1 U3.8(NC2)
NetP3_2: P3.2 U3.4(NC1)
NetQ1_B: Q1.B Q2.C R5.1
NetQ1_C: Q1.C R3.1 U1.1(~{SD}) U1.2(~{FAULT})
NetQ2_B: Q2.B R7.2
NetR1_1: R1.1 U3.5(IN1) U3.7(IN2) ; port AUDIO_MUX_PA_CTRL.MUX_MIC
NetR9_1: R9.1 SW1.1 U1.5(GAIN0)
NetR10_1: R10.1 SW1.2 U1.6(GAIN1)

Not connected (* = marked no-connect by the designer): J1 3(RING1) 4(RING2) 6(RING_SWITCH); J2 1; J3 3(RING1) 4(RING2) 6(RING_SWITCH); J4 3(RING1) 4(RING2) 6(RING_SWITCH); P17 1 10; U1 13(NC)

### Layout directives
differential pair: NetC6_2, NetC7_2

### Notes on the sheet
- A_MUX inicialmente en 0 -> ISD2360 direccionado al principio
- Max 1.3A peak
- M_microcontrolador
- (in symbol AUDIO AMP_TPA3111D1_28-TSSOP-EP_EIL) TPA3111D1; 10W CLASS D; POWER AMP
- (in symbol MUXA_TS5A22362DGSR_10-MSOP_EIL) 2 SPDT +/- SW

### Library data of the parts
C1 C2 C5 C16 C17 = PASS_CAP_EIL: CAP CER 0.1UF 25V X7R 0603; PartNo: CL10B104KA8NNNC; Manufacturer Name: Samsung Electro-Mechanics; PartDescription: CAP CER 0.1UF 50V Y5V 0603; Type: Surface Mount; Package: 0603 (1608 Metric); Digi-Key Part Number: 1276-1012-1-ND; Distributors Part Number: 1276-1012-1-ND; Manufacturers Part Number: CL10B104KA8NNNC
C3 C10 C11 = PASS_CAP_EIL: CAP CER 1000PF 50V X7R 0603; PartNo: 06035C102KAT2A; Manufacturer Name: AVX Corporation; PartDescription: CAP CER 1000PF 50V C0G/NP0 0603; Type: Surface Mount; Package: 0603 (1608 Metric); Digi-Key Part Number: 478-5005-1-ND; Distributors Part Number: 478-5005-1-ND; Manufacturers Part Number: 06035C102KAT2A
C4 = PASS_CAPPOL_EIL: CAP ALUM 100UF 20% 35V SMD; PartNo: EEE-FP1V101AP; Manufacturer Name: Panasonic Electronic Components; Type: Surface Mount; Package: Radial, Can - SMD; Digi-Key Part Number: PCE4442CT-ND; Distributors Part Number: PCE4442CT-ND; Manufacturers Part Number: EEE-FP1V101AP; PartDescription: CAP ALUM 100UF 20% 35V SMD
C6 C7 C12 = PASS_CAP_EIL: CAP CER 1UF 10V X7R 0603; PartNo: LMK107B7105KA-T; Manufacturer Name: AVX Corporation; Type: Surface Mount; Package: 0603 (1608 Metric); Digi-Key Part Number: 478-7940-1-ND; Distributors Part Number: 478-7940-1-ND; Manufacturers Part Number: LMK107B7105KA-T; PartDescription: AVX Corporation
C8 C14 = PASS_CAP_EIL: CAP CER 0.47UF 16V X7R 0603; PartNo: C1608X7R1C474K080AC; Manufacturer Name: Murata Electronics North America; Type: Surface Mount; Package: 0603 (1608 Metric); Digi-Key Part Number: 490-4775-1-ND; Distributors Part Number: 490-4775-1-ND; Manufacturers Part Number: C1608X7R1C474K080AC; PartDescription: CAP CER 0.47UF 16V X7R 0603
C9 C13 = PASS_CAP_EIL: CAP CER 0.68UF 50V X7R 1206; PartNo: C3216X7R1H684K160AA; Manufacturer Name: TDK Corporation; Type: Surface Mount; Package: 1206 (3216 Metric); Digi-Key Part Number: 445-4013-1-ND; Distributors Part Number: 445-4013-1-ND; Manufacturers Part Number: C3216X7R1H684K160AA; PartDescription: CAP CER 0.68UF 50V X7R 1206
C15 = PASS_CAP_EIL: CAP CER 10UF 25V X5R 0805; PartNo: CC0805ZKY5V6BB106; Manufacturer Name: Yageo; PartDescription: CAP CER 10UF 10V Y5V 0805; Type: Surface Mount; Package: 0805; Digi-Key Part Number: 311-1355-1-ND; Distributors Part Number: 311-1355-1-ND; Manufacturers Part Number: CC0805ZKY5V6BB106
C35 C36 = PASS_CAP_EIL: CAP CER 0.1UF 25V X7R 0603; PartNo: CL10B101KB8NNNC; Manufacturer Name: Samsung Electro-Mechanics; PartDescription: CAP CER 100PF 50V X7R 0603; Type: Surface Mount; Package: 0603 (1608 Metric); Digi-Key Part Number: 1276-1909-1-ND; Distributors Part Number: 1276-1909-1-ND; Manufacturers Part Number: CL10B101KB8NNNC
J1 J3 J4 = SJ-43515RS-SMT: PartNo: SJ-43515RS-SMT-TR; Manufacturer Name: CUI Inc.; PartDescription: CONN JACK 4COND 3.5MM SMD R/A; Value: *; Digi-Key Part Number: CP-43515RSSJCT-ND; Distributors Part Number: CP-43515RSSJCT-ND; Manufacturers Part Number: SJ-43515RS-SMT-TR; Type: Surface Mount
J2 = 5747844-6: Imported; Manufacturer Name: TE Connectivity AMP Connectors; PartDescription: CONN D-SUB RCPT 9POS R/A SOLDER; Review: No instalar; Digi-Key Part Number: A32119-ND; PartNo: 5747844-6; Distributors Part Number: A32119-ND; Manufacturers Part Number: 5747844-6; Package: 9 Position D-Sub Receptacle; Type: Through Hole
L1 L4 L6 L8 = PASS_FERRITEBEAD_EIL: FERRITE BEAD 220 OHM 0805 1LN; PartNo: MH2029-221Y; Manufacturer Name: Bourns Inc.; Type: Surface Mount; Package: 0805 (2012 Metric); Digi-Key Part Number: MH2029-221YCT-ND; Distributors Part Number: MH2029-221YCT-ND; Manufacturers Part Number: MH2029-221Y; PartDescription: FERRITE BEAD 220 OHM 0805 1LN
L2 L7 = PASS_FERRITEBEAD_EIL: FERRITE BEAD 70 OHM 1812 1LN; PartNo: 742792510; Manufacturer Name: Wurth Electronics Inc.; Value: 70 Ohm@100MHz; Type: Surface Mount; Package: 1812 (4532 Metric); Digi-Key Part Number: 732-1640-1-ND; Distributors Part Number: 732-1640-1-ND; Manufacturers Part Number: 742792510; PartDescription: FERRITE BEAD 70 OHM 1812 1LN
L3 L5 = PASS_L_EIL: FIXED IND 22UH 3A 60 MOHM SMD; PartNo: SRU1063-220Y; Manufacturer Name: Bourns Inc.; Type: Surface Mount; Package: 0.394" L x 0.394" W (10.00mm x 10.00mm); Digi-Key Part Number: SRU1063-220YCT-ND; Distributors Part Number: SRU1063-220YCT-ND; Manufacturers Part Number: SRU1063-220Y; PartDescription: FIXED IND 22UH 3A 60 MOHM SMD
P1 P3 = TBHDR2P3.5: as P4 on sheet M_GPIO_ADC; Digi-Key Part Number: 732-2763-ND; Package: 0.138" (3.50mm) Vertical Through Hole; Distributors Part Number: 732-2763-ND; Manufacturers Part Number: 691321100002; Type: Through Hole; Value: 2 Position
P2 = TBHDR2P3.5: Connector 2 positions with pitch 3.5mm; PartNo: 691321100002; PartDescription: TERM BLOCK HDR 2POS VERT 3.5MM; Manufacturer Name: Wurth Electronics Inc.; Digi-Key Part Number: 732-2763-ND; Package: 0.138" (3.50mm) Vertical Through Hole; Type: Through Hole; Manufacturers Part Number: 691321100002; Distributors Part Number: 732-2763-ND; Value: 2 Position
P17 = TBBTB2x5: Connector board to board 2 Rows, 5 Columns Pitch 2.54mm; Manufacturer Name: On Shore Technology Inc.; Manufacturers Part Number: 302-S101; PartDescription: CONN HEADER VERT 10POS 2.54MM; Digi-Key Part Number: ED1543-ND; Distributors Part Number: ED1543-ND; PartNo: 302-S101; Type: Through Hole
Q1 Q2 = TRAN_BJT_NPN_EIL: TRANS NPN 45V 0.5A SOT23; PartNo: BC817-40LT1G; Manufacturer Name: ON Semiconductor; Type: Surface Mount; Package: TO-236-3, SC-59, SOT-23-3; Digi-Key Part Number: BC817-40LT1GOSCT-ND; Distributors Part Number: BC817-40LT1GOSCT-ND; Manufacturers Part Number: BC817-40LT1G; PartDescription: TRANS NPN 45V 0.5A SOT23
R1 R11 = PASS_R_EIL: RES SMD 10K OHM 1% 1/10W 0603; PartNo: RC0805FR-0710KL; Manufacturer Name: Yageo; PartDescription: RES SMD 10K OHM 1% 1/8W 0805; Package: 0805 (2012 Metric); Digi-Key Part Number: 311-10.0KCRCT-ND; Distributors Part Number: 311-10.0KCRCT-ND; Manufacturers Part Number: RC0805FR-0710KL; Type: Surface Mount
R3 R5 R9 R10 = PASS_R_EIL: RES SMD 100K OHM 1% 1/10W 0603; PartNo: RC0603FR-07100KL; Manufacturer Name: Yageo; PartDescription: RES SMD 100K OHM 1% 1/8W 0805; Package: 0603 (1608 Metric); Digi-Key Part Number: YAG3359CT-ND; Distributors Part Number: YAG3359CT-ND; Manufacturers Part Number: RC0603FR-07100KL; Type: Surface Mount
R7 = PASS_R_EIL: RES SMD 3.9K OHM 1% 1/10W 0603; PartNo: RC0603FR-073K9L; Manufacturer Name: Yageo; Package: 0603 (1608 Metric); Digi-Key Part Number: 311-3.90KHRCT-ND; Distributors Part Number: 311-3.90KHRCT-ND; Manufacturers Part Number: RC0603FR-073K9L; PartDescription: RES SMD 3.9K OHM 1% 1/10W 0603; Type: Surface Mount
R8 = PASS_R_EIL: RES SMD 10 OHM 1% 1/10W 0603; PartNo: RC0603FR-0710RL; Manufacturer Name: Stackpole Electronics Inc; PartDescription: RES 10 OHM 1% 1/4W 0805; Package: 0603 (1608 Metric); Digi-Key Part Number: RNCP0805FTD10R0CT-ND; Distributors Part Number: RNCP0805FTD10R0CT-ND; Manufacturers Part Number: RC0603FR-0710RL; Type: Surface Mount
SW1 = SW_DIP2_EIL: SWITCH TIN CONT 2 SEC 50V; PartNo: 208-2; Manufacturer Name: CTS Electrocomponents; PartDescription: SWITCH SLIDE DIP SPST 50MA 24V; Value: DIP SWITCH 2; Digi-Key Part Number: CT2082-ND; Distributors Part Number: CT2082-ND; Manufacturers Part Number: 208-2; Package: 0.100" (2.54mm), Full; Type: Through Hole
TP1 = TEST POINT_EIL: TESTPOINT; PartNo: NO; Value: NO; Package: NO; Manufacturers Part Number: NO
U1 = AUDIO AMP_TPA3111D1_28-TSSOP-EP_EIL: IC AMP AUD PWR 10W MONO 28HTSSOP_AMPLIFICADOR CLASE D 10W 28-HTSSOP EXPOSED PAD; PartNo: TPA3111D1PWPR; Manufacturer Name: Texas Instruments; Package: 28-PowerTSSOP (0.173", 4.40mm Width); Value: TPA3111; Digi-Key Part Number: 296-25121-1-ND; Distributors Part Number: 296-25121-1-ND; Manufacturers Part Number: TPA3111D1PWPR; PartDescription: IC AMP AUD PWR 10W MONO 28HTSSOP; Type: Surface Mount
U2 U3 = MUXA_TS5A22362DGSR_10-MSOP_EIL: IC SWITCH DUAL SPDT 10MSOP_5-V/3.3-V 2-CHANNEL 2:1 MULTIPLEXER/DEMULTIPLEXER ANALOGICO +/- VIN 10-MSOP; Manufacturer Name: Texas Instruments; Package: 10-TFSOP, 10-MSOP (0.118", 3.00mm Width); PartNo: TS5A22362DGSR; Value: TS5A22362; Digi-Key Part Number: 296-24799-1-ND; Distributors Part Number: 296-24799-1-ND; Manufacturers Part Number: TS5A22362DGSR; PartDescription: IC SWITCH DUAL SPDT 10MSOP; Type: Surface Mount

## Sheet M_PWR.SchDoc
size Letter
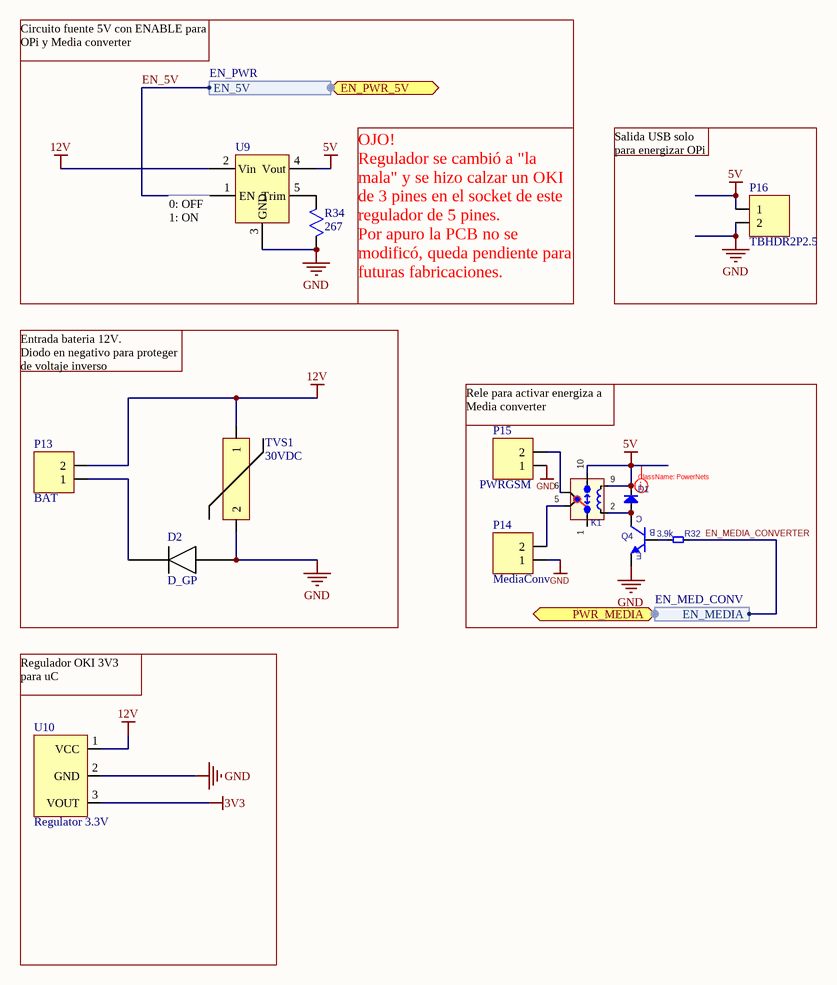
[diagram p3: M_PWR.SchDoc]

### Parts
D1  DIODE_EIL  [DIOD_SOD123 - REFLOW]  (value not drawn)
D2  D_GP  [SMA]
K1  RELAY_METALTEX_MB1RC-5V_SPDT_EIL  [RELAY_METALTEX_MB1RC-5V_SPDT THR]  (value not drawn)
P13  BAT  [TBHDR2P3.5VERTICAL]
P14  MediaConv  [TBHDR2P3.5VERTICAL]
P15  PWRGSM  [TBHDR2P3.5VERTICAL]
P16  TBHDR2P2.5  [TBR2.5]
Q4  TRAN_BJT_NPN_EIL  [3PIN_SOT-23 BJT - REFLOW]  (value not drawn)
R32  value 3.9k  [PASS_RESC0603 - REFLOW]  (hidden comment: PASS_R_EIL)
R34  267  [ResistorSMD0805]
TVS1  30VDC  [Varistor]
U9  DCDC 5V/3A  [OKR]  (value not drawn)
U10  Regulator 3.3V  [OKI78SR]

### Ports
EN_PWR_5V (harness EN_PWR), PWR_MEDIA (harness EN_MED_CONV)

### Harnesses
EN_PWR: EN_5V
EN_MED_CONV: EN_MEDIA

### Nets
3V3: U10.3(VOUT)
5V: D1.K K1.9 K1.10 P16.1 U9.4(Vout)
12V: P13.2 TVS1.1 U9.2(Vin) U10.1(VCC)
GND: D2.2 P14.1 P15.1 P16.2 Q4.E R34.2 TVS1.2 U9.3(GND) U10.2(GND)  [project net GND-GSM]
EN_5V: U9.1(EN) ; port EN_PWR_5V.EN_5V
EN_MEDIA_CONVERTER: R32.2 ; port PWR_MEDIA.EN_MEDIA
NetD1_A: D1.A K1.2 Q4.C
NetD2_1: D2.1 P13.1
NetK1_5: K1.5 P14.2
NetK1_6: K1.6 P15.2
NetQ4_B: Q4.B R32.1
NetR34_1: R34.1 U9.5(Trim)

Not connected (* = marked no-connect by the designer): K1 1

### Layout directives
net class PowerNets: 5V

### Notes on the sheet
- Circuito fuente 5V con ENABLE para OPi y Media converter
- Salida USB solo para energizar OPi
- (near U9) 0: OFF
  1: ON
- (near R34) OJO!
  Regulador se cambió a "la mala" y se hizo calzar un OKI de 3 pines en el socket de este regulador de 5 pines.
  Por apuro la PCB no se modificó, queda pendiente para futuras fabricaciones.
- Entrada bateria 12V.
  Diodo en negativo para proteger de voltaje inverso
- (near P15) Rele para activar energiza a Media converter
- Regulador OKI 3V3 para uC

### Library data of the parts
D1 = DIODE_EIL: DIODE GEN PURP 100V 150MA SOD123; PartNo: 1N4148W-TP; Manufacturer Name: Micro Commercial Co; Value: 1N4148; Type: Surface Mount; Package: SOD-123; Digi-Key Part Number: 1N4148WTPMSCT-ND; Distributors Part Number: 1N4148WTPMSCT-ND; Manufacturers Part Number: 1N4148W-TP; PartDescription: DIODE GEN PURP 100V 150MA SOD123
D2 = D_GP: Single Diode Rectifier SMD; PartNo: CDBA540-HF; Manufacturer Name: Comchip Technology; PartDescription: DIODE SCHOTTKY 40V 5A DO214AC; Type: Surface Mount; Digi-Key Part Number: 641-1707-1-ND; Package: DO-214AC, SMA; Distributors Part Number: 641-1707-1-ND; Manufacturers Part Number: CDBA540-HF
K1 = RELAY_METALTEX_MB1RC-5V_SPDT_EIL: RELAY GENERAL PURPOSE SPDT 1A 5V; PartNo: G5V-1-DC5; Manufacturer Name: Panasonic Electric Works; PartDescription: RELAY TELECOM SPDT 1A 5VDC; Value: 5V/CONTACTO 1A; Package: *; Digi-Key Part Number: 255-1092-ND; Distributors Part Number: 255-1092-ND; Manufacturers Part Number: G5V-1-DC5; Type: Through Hole
P13-P15 = TBHDR2P3.5: as P4 on sheet M_GPIO_ADC; Digi-Key Part Number: 732-2763-ND; Package: 0.138" (3.50mm) Vertical Through Hole; Distributors Part Number: 732-2763-ND; Manufacturers Part Number: 691321100002; Type: Through Hole; Value: 2 Position
P16 = TBHDR2P3.5: Connector 2 positions with pitch 3.5mm; Manufacturer Name: Phoenix Contact; Manufacturers Part Number: 1778625; PartDescription: TERM BLOCK HDR 2POS 90DEG 2.5MM; Digi-Key Part Number: 277-2308-1-ND; Distributors Part Number: 277-2308-1-ND; PartNo: 1778625; Type: Through Hole
Q4 = TRAN_BJT_NPN_EIL: as Q1 on sheet M_Audio; Package: TO-236-3, SC-59, SOT-23-3; Digi-Key Part Number: BC817-40LT1GOSCT-ND; Distributors Part Number: BC817-40LT1GOSCT-ND; Manufacturers Part Number: BC817-40LT1G; PartDescription: TRANS NPN 45V 0.5A SOT23
R32 = PASS_R_EIL: as R7 on sheet M_Audio; Package: 0603 (1608 Metric); Digi-Key Part Number: 311-3.90KHRCT-ND; Distributors Part Number: 311-3.90KHRCT-ND; Manufacturers Part Number: RC0603FR-073K9L; PartDescription: RES SMD 3.9K OHM 1% 1/10W 0603; Type: Surface Mount
R34 = ResistorSMD: Chip Resistor SMD; Manufacturer Name: Panasonic Electronic Components; Manufacturers Part Number: ERJ-PB3D2670V; PartDescription: RES SMD 267 OHM 0.5% 1/5W 0603; Digi-Key Part Number: P20215CT-ND; Value: 267; Distributors Part Number: P20215CT-ND; Package: 0603 (1608 Metric); PartNo: ERJ-PB3D2670V; Type: Surface Mount
TVS1 = Varistor: Varistor SMD; Manufacturer Name: Panasonic Electronic Components; Manufacturers Part Number: ERZ-VF2M330; PartDescription: VARISTOR 33V 125A 2SMD JLEAD; Digi-Key Part Number: P7347CT-ND; Distributors Part Number: P7347CT-ND; Package: 2-SMD, J-Lead; PartNo: ERZ-VF2M330; Type: Surface Mount
U9 = DCDC 5V/3A: Non-Isolated PoL Module DC DC Converter 1 Output 0.59 ~ 6 V 3A 4.5V - 14V Input; PartNo: OKR-T/3-W12-C; Manufacturer Name: Murata Power Solutions Inc.; PartDescription: DC DC CONVERTER 0.59-6V 15W; Digi-Key Part Number: 811-2115-5-ND; Package: 5-SIP Module; Distributors Part Number: 811-2115-5-ND; Manufacturers Part Number: OKR-T/3-W12-C; Type: Through Hole
U10 = OKI78SR: Regulator DC-DC 3.3V 1.5A; PartNo: OKI-78SR-3.3/1.5-W36-C; Manufacturer Name: Murata Power Solutions Inc.; PartDescription: DC DC CONVERTER 3.3V 5W; Digi-Key Part Number: 811-2195-5-ND; Package: 3-SIP Module; Distributors Part Number: 811-2195-5-ND; Manufacturers Part Number: OKI-78SR-3.3/1.5-W36-C; Type: Through Hole

## Nets that join several sheets
3V3: M_GPIO_ADC (5 pins), M_microcontrolador (19 pins), M_Audio (L1.1 L8.1 R5.2), M_PWR (U10.3)
12V: M_GPIO_ADC (R13.1), M_Audio (11 pins), M_PWR (P13.2 TVS1.1 U9.2 U10.1)
GND-GSM: M_GPIO_ADC (13 pins), M_microcontrolador (28 pins), M_Audio (30 pins), M_PWR (9 pins)
A_MUX_CTRL: M_microcontrolador (U7.26), M_Audio (R11.1 U2.5 U2.7)
BTN_IN: M_GPIO_ADC (P7.2 R19.1), M_microcontrolador (U7.36)
DI1: M_GPIO_ADC (P8.2 R24.1), M_microcontrolador (U7.34)
DI2: M_GPIO_ADC (P9.2 R25.1), M_microcontrolador (U7.35)
EN_5V: M_microcontrolador (U7.43), M_PWR (U9.1)
EN_MEDIA_CONVERTER: M_microcontrolador (U7.44), M_PWR (R32.2)
GPIOx1: M_GPIO_ADC (R18.1), M_microcontrolador (U7.5)
GPIOx2: M_GPIO_ADC (R20.1), M_microcontrolador (U7.4)
GPIOx3: M_GPIO_ADC (R23.1), M_microcontrolador (U7.3)
GPIOx4: M_GPIO_ADC (R12.1), M_microcontrolador (U7.38)
GPIOx5: M_GPIO_ADC (R15.1), M_microcontrolador (U7.37)
LED_BTN_CTR: M_GPIO_ADC (R22.1), M_microcontrolador (U7.2)
NetR1_1: M_microcontrolador (U7.25), M_Audio (R1.1 U3.5 U3.7)
RST-GSM: M_microcontrolador (U7.14), M_Audio (J2.4 P17.4)
RX-GSM: M_microcontrolador (U11.13), M_Audio (J2.3)
RX_GSM: M_microcontrolador (U7.8 U11.11), M_Audio (P17.3)
SD_TPA3111: M_microcontrolador (U7.27), M_Audio (R7.1)
TX-GSM: M_microcontrolador (U11.14), M_Audio (J2.2)
TX_GSM: M_microcontrolador (U7.9 U11.12), M_Audio (P17.2)
Vbat_ADC: M_GPIO_ADC (U5.1 U5.2), M_microcontrolador (U7.11)
Vpv_ADC: M_GPIO_ADC (U5.6 U5.7), M_microcontrolador (U7.15)